# EAGLE design ctrl (EAGLE 8.2.2)
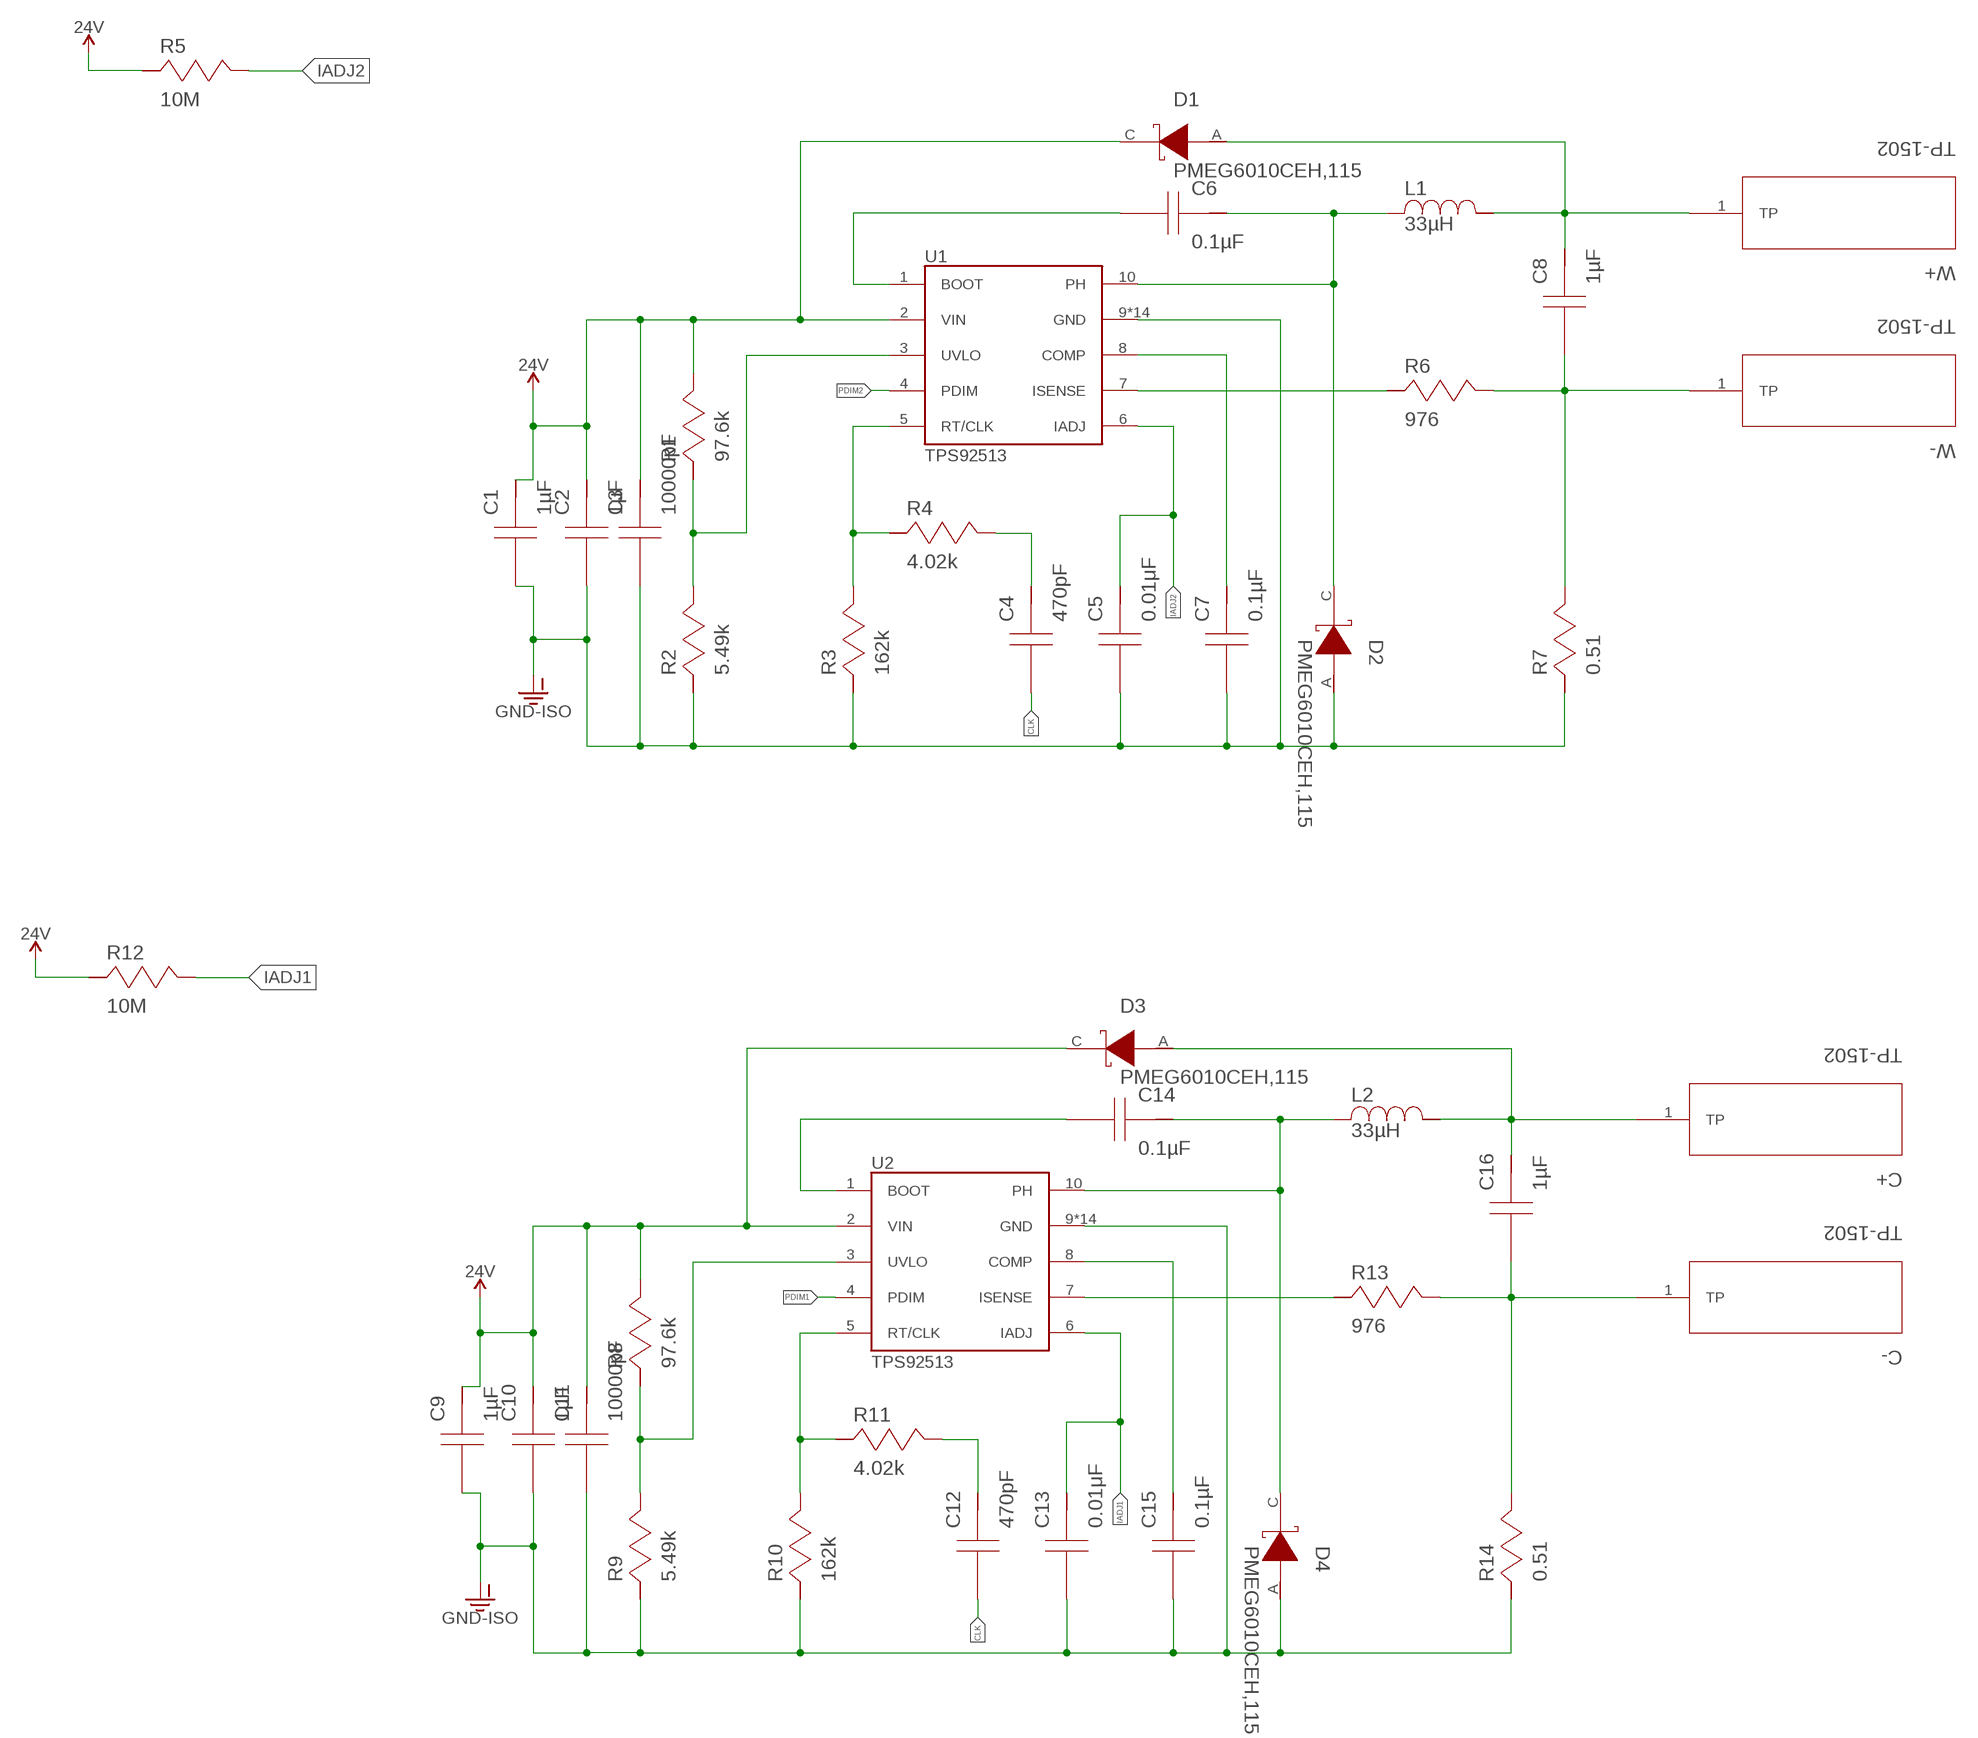
[diagram p0: schematic, sheet 1, part 1 of 2]
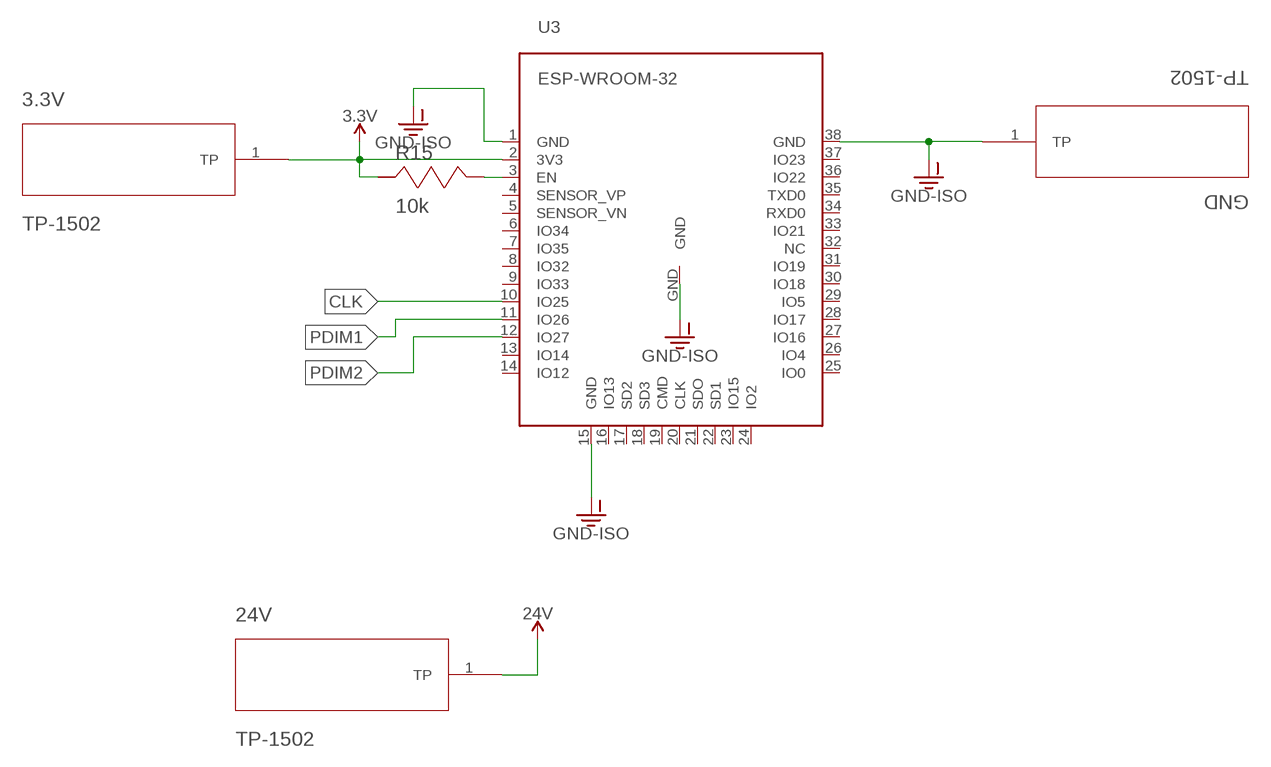
[diagram p1: schematic, sheet 1, part 2 of 2]

## Parts
3.3V  TP-1502  [TP-1502]
24V  TP-1502  [TP-1502]
C1  1µF  GRM31MR71H105KA88L  [1206]
C2  1µF  GRM31MR71H105KA88L  [1206]
C3  10000pF  GCM155R71H103KA55D  [0402]
C4  470pF  C0603X471K5RACTU  [0603]
C5  0.01μF  CC0805KRX7R9BB103  [0805]
C6  0.1µF  GRM188R71E104KA01D  [0603]
C7  0.1µF  CC0805KRX7R8BB104  [0805]
C8  1µF  GMK212B7105KG-T  [0805]
C9  1µF  GRM31MR71H105KA88L  [1206]
C10  1µF  GRM31MR71H105KA88L  [1206]
C11  10000pF  GCM155R71H103KA55D  [0402]
C12  470pF  C0603X471K5RACTU  [0603]
C13  0.01μF  CC0805KRX7R9BB103  [0805]
C14  0.1µF  GRM188R71E104KA01D  [0603]
C15  0.1µF  CC0805KRX7R8BB104  [0805]
C16  1µF  GMK212B7105KG-T  [0805]
C+  TP-1502  [TP-1502]
C-  TP-1502  [TP-1502]
D1  PMEG6010CEH,115  [SOD-123F]
D2  PMEG6010CEH,115  [SOD-123F]
D3  PMEG6010CEH,115  [SOD-123F]
D4  PMEG6010CEH,115  [SOD-123F]
GND  TP-1502  [TP-1502]
L1  33µH  SRN6045-330M  [SRN6045]
L2  33µH  SRN6045-330M  [SRN6045]
R1  97.6k  CRCW040297K6FKED  [0402]
R2  5.49k  CRCW04025K49FKED  [0402]
R3  162k  CRCW0402162KFKED  [0402]
R4  4.02k  CRCW06034K02FKEA  [0603]
R5  10M  CRCW040210M0JNED  [0402]
R6  976  CRCW0402976RFKED  [0402]
R7  0.51  CRM0805-FX-R510ELF  [0805]
R8  97.6k  CRCW040297K6FKED  [0402]
R9  5.49k  CRCW04025K49FKED  [0402]
R10  162k  CRCW0402162KFKED  [0402]
R11  4.02k  CRCW06034K02FKEA  [0603]
R12  10M  CRCW040210M0JNED  [0402]
R13  976  CRCW0402976RFKED  [0402]
R14  0.51  CRM0805-FX-R510ELF  [0805]
R15  10k  CRCW060310K0FKEA  [0603]
U1  TPS92513  [TPS92513]
U2  TPS92513  [TPS92513]
U3  ESP-WROOM-32  [ESP-WROOM-32]
W+  TP-1502  [TP-1502]
W-  TP-1502  [TP-1502]

## Nets
3.3V: 3.3V.1(TP) R15.2 U3.2(3V3)
24V: 24V.1(TP) C1.1 C2.1 C3.1 C9.1 C10.1 C11.1 D1.C D3.C R1.1 R5.2 R8.1 R12.2 U1.2(VIN) U2.2(VIN)
CLK: C4.2 C12.2 U3.10(IO25)
GND-ISO: C1.2 C2.2 C3.2 C5.2 C7.2 C9.2 C10.2 C11.2 C13.2 C15.2 D2.A D4.A GND.1(TP) R2.2 R3.2 R7.2 R9.2 R10.2 R14.2 U1.9(GND) U1.GND-ISO(GND) U1.P$1(GND) U1.P$2(GND) U1.P$3(GND) U1.P$4(GND) U1.P$5(GND) U1.P$6(GND) U1.P$7(GND) U1.P$8(GND) U1.P$9(GND) U1.P$10(GND) U1.P$11(GND) U1.P$12(GND) U2.9(GND) U2.GND-ISO(GND) U2.P$1(GND) U2.P$2(GND) U2.P$3(GND) U2.P$4(GND) U2.P$5(GND) U2.P$6(GND) U2.P$7(GND) U2.P$8(GND) U2.P$9(GND) U2.P$10(GND) U2.P$11(GND) U2.P$12(GND) U3.1(GND) U3.15(GND) U3.38(GND) U3.GND
IADJ1: C13.1 R12.1 U2.6(IADJ)
IADJ2: C5.1 R5.1 U1.6(IADJ)
N$1: R1.2 R2.1 U1.3(UVLO)
N$2: R8.2 R9.1 U2.3(UVLO)
N$3: C14.1 D4.C L2.1 U2.10(PH)
N$4: R10.1 R11.2 U2.5(RT/CLK)
N$5: C15.1 U2.8(COMP)
N$6: C14.2 U2.1(BOOT)
N$7: R13.2 U2.7(ISENSE)
N$8: C12.1 R11.1
N$9: C16.1 C+.1(TP) D3.A L2.2
N$10: C16.2 C-.1(TP) R13.1 R14.1
N$16: C6.1 D2.C L1.1 U1.10(PH)
N$17: R3.1 R4.2 U1.5(RT/CLK)
N$18: C7.1 U1.8(COMP)
N$19: C6.2 U1.1(BOOT)
N$20: R6.2 U1.7(ISENSE)
N$23: C8.1 D1.A L1.2 W+.1(TP)
N$25: C4.1 R4.1
N$26: C8.2 R6.1 R7.1 W-.1(TP)
N$29: R15.1 U3.3(EN)
PDIM1: U2.4(PDIM) U3.11(IO26)
PDIM2: U1.4(PDIM) U3.12(IO27)
Unconnected: U3.4(SENSOR_VP) U3.5(SENSOR_VN) U3.6(IO34) U3.7(IO35) U3.8(IO32) U3.9(IO33) U3.13(IO14) U3.14(IO12) U3.16(IO13) U3.17(SD2) U3.18(SD3) U3.19(CMD) U3.20(CLK) U3.21(SDO) U3.22(SD1) U3.23(IO15) U3.24(IO2) U3.25(IO0) U3.26(IO4) U3.27(IO16) U3.28(IO17) U3.29(IO5) U3.30(IO18) U3.31(IO19) U3.32(NC) U3.33(IO21) U3.34(RXD0) U3.35(TXD0) U3.36(IO22) U3.37(IO23)

## Library data of the parts
3.3V 24V C+ C- GND W+ W- = derek:TP-1502
C1 C2 C9 C10 = derek:GRM31MR71H105KA88L; DATASHEET_URL: http://www.murata.com/~/media/webrenewal/support/library/catalog/products/capacitor/mlcc/c02e.ashx; DIGIKEY_PART_NUMBER: 490-6527-1-ND; PART_NUMBER: GRM31MR71H105KA88L
C3 C11 = derek:GCM155R71H103KA55D; DATASHEET_URL: http://psearch.en.murata.com/capacitor/product/GCM155R71H103KA55%23.pdf; DIGIKEY_PART_NUMBER: 490-4762-1-ND; PART_NUMBER: GCM155R71H103KA55D
C4 C12 = derek:C0603X471K5RACTU; DATASHEET_URL: http://www.kemet.com/docfinder?Partnumber=C0603X471K5RACTU; DIGIKEY_PART_NUMBER: 399-5338-1-ND; MANUFACTURER: KEMET; PART_NUMBER: C0603X471K5RACTU
C5 C13 = derek:CC0805KRX7R9BB103; DATASHEET_URL: http://www.yageo.com/documents/recent/UPY-GPHC_X7R_6.3V-to-50V_17.pdf; DIGIKEY_PART_NUMBER: 311-1136-1-ND; PART_NUMBER: CC0805KRX7R9BB103
C6 C14 = derek:GRM188R71E104KA01D; DATASHEET_URL: http://www.murata.com/~/media/webrenewal/support/library/catalog/products/capacitor/mlcc/c02e.ashx; DIGIKEY_PART_NUMBER: 490-1524-1-ND; MANUFACTURER: Murata Electronics North America; PART_NUMBER: GRM188R71E104KA01D
C7 C15 = derek:CC0805KRX7R8BB104; DATASHEET_URL: http://www.yageo.com/documents/recent/UPY-GPHC_X7R_6.3V-to-50V_17.pdf; DIGIKEY_PART_NUMBER: 311-1141-1-ND; PART_NUMBER: CC0805KRX7R8BB104
C8 C16 = derek:GMK212B7105KG-T; DATASHEET_URL: http://ds.yuden.co.jp/TYCOMPAS/ut/detail.do?productNo=GMK212B7105KG-T&fileName=GMK212B7105KG-T_SS&mode=specSheetDownload; DIGIKEY_PART_NUMBER: 587-1438-1-ND; PART_NUMBER: GMK212B7105KG-T
D1-D4 = derek:PMEG6010CEH,115; DATASHEET_URL: http://assets.nexperia.com/documents/data-sheet/PMEG6010CEH_PMEG6010CEJ.pdf; DIGIKEY_PART_NUMBER: 1727-3848-1-ND; PART_NUMBER: PMEG6010CEH,115
L1 L2 = derek:SRN6045-330M; DATASHEET_URL: http://www.bourns.com/docs/Product-Datasheets/SRN6045.pdf; DIGIKEY_PART_NUMBER: SRN6045-330MCT-ND; PART_NUMBER: SRN6045-330M
R1 R8 = derek:CRCW040297K6FKED; DATASHEET_URL: http://www.vishay.com/docs/20035/dcrcwe3.pdf; DIGIKEY_PART_NUMBER: 541-97.6KLCT-ND; PART_NUMBER: CRCW040297K6FKED
R2 R9 = derek:CRCW04025K49FKED; DATASHEET_URL: http://www.vishay.com/docs/20035/dcrcwe3.pdf; DIGIKEY_PART_NUMBER: 541-5.49KLCT-ND; PART_NUMBER: CRCW04025K49FKED
R3 R10 = derek:CRCW0402162KFKED; DATASHEET_URL: http://www.vishay.com/docs/20035/dcrcwe3.pdf; DIGIKEY_PART_NUMBER: 541-162KLCT-ND; PART_NUMBER: CRCW0402162KFKED
R4 R11 = derek:CRCW06034K02FKEA; DATASHEET_URL: http://www.vishay.com/docs/20035/dcrcwe3.pdf; DIGIKEY_PART_NUMBER: 541-4.02KHCT-ND; MANUFACTURER: Vishay Dale; PART_NUMBER: CRCW06034K02FKEA
R5 R12 = derek:CRCW040210M0JNED; DATASHEET_URL: http://www.vishay.com/docs/20035/dcrcwe3.pdf; DIGIKEY_PART_NUMBER: 541-10MJCT-ND; MANUFACTURER: Vishay Dale; PART_NUMBER: CRCW040210M0JNED
R6 R13 = derek:CRCW0402976RFKED; DATASHEET_URL: http://www.vishay.com/docs/20035/dcrcwe3.pdf; DIGIKEY_PART_NUMBER: 541-976LCT-ND; PART_NUMBER: CRCW0402976RFKED
R7 R14 = derek:CRM0805-FX-R510ELF; DATASHEET_URL: http://www.bourns.com/docs/Product-Datasheets/CRM0805_1206_2010.pdf; DIGIKEY_PART_NUMBER: CRM0805-FX-R510ELFCT-ND; PART_NUMBER: CRM0805-FX-R510ELF
R15 = derek:CRCW060310K0FKEA; DATASHEET_URL: http://www.vishay.com/docs/20035/dcrcwe3.pdf; DIGIKEY_PART_NUMBER: 541-10.0KHCT-ND; MANUFACTURER: Vishay Dale; PART_NUMBER: CRCW060310K0FKEA
U1 U2 = derek:TPS92513; DATASHEET_URL: http://www.ti.com/lit/ds/symlink/tps92513.pdf; DIGIKEY_PART_NUMBER: 296-42113-1-ND; PART_NUMBER: TPS92513DGQT
U3 = derek:ESP-WROOM-32

## Board
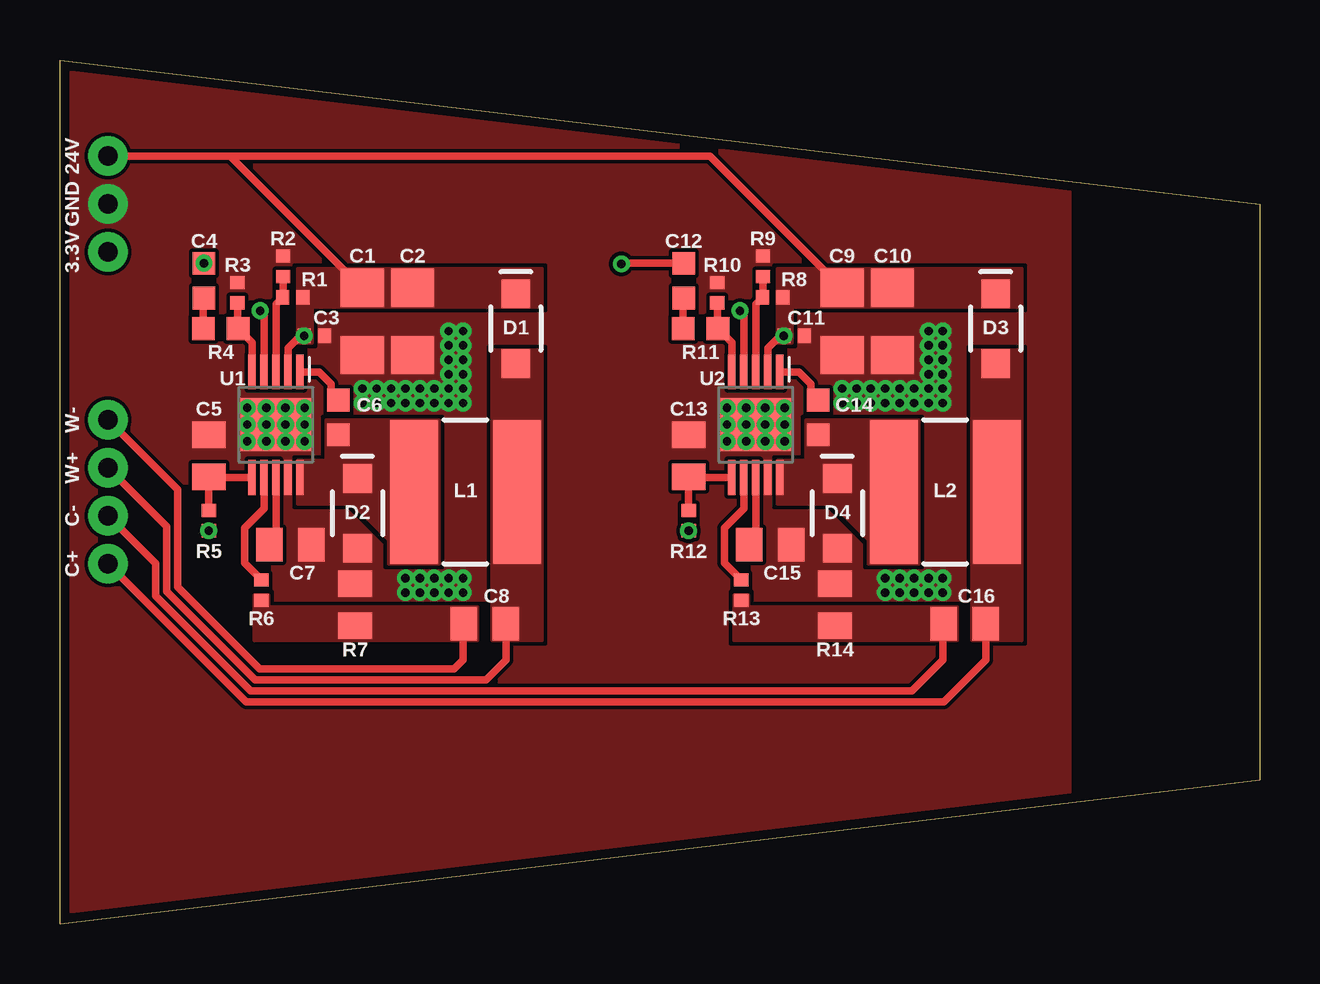
[diagram p2: board, top side]
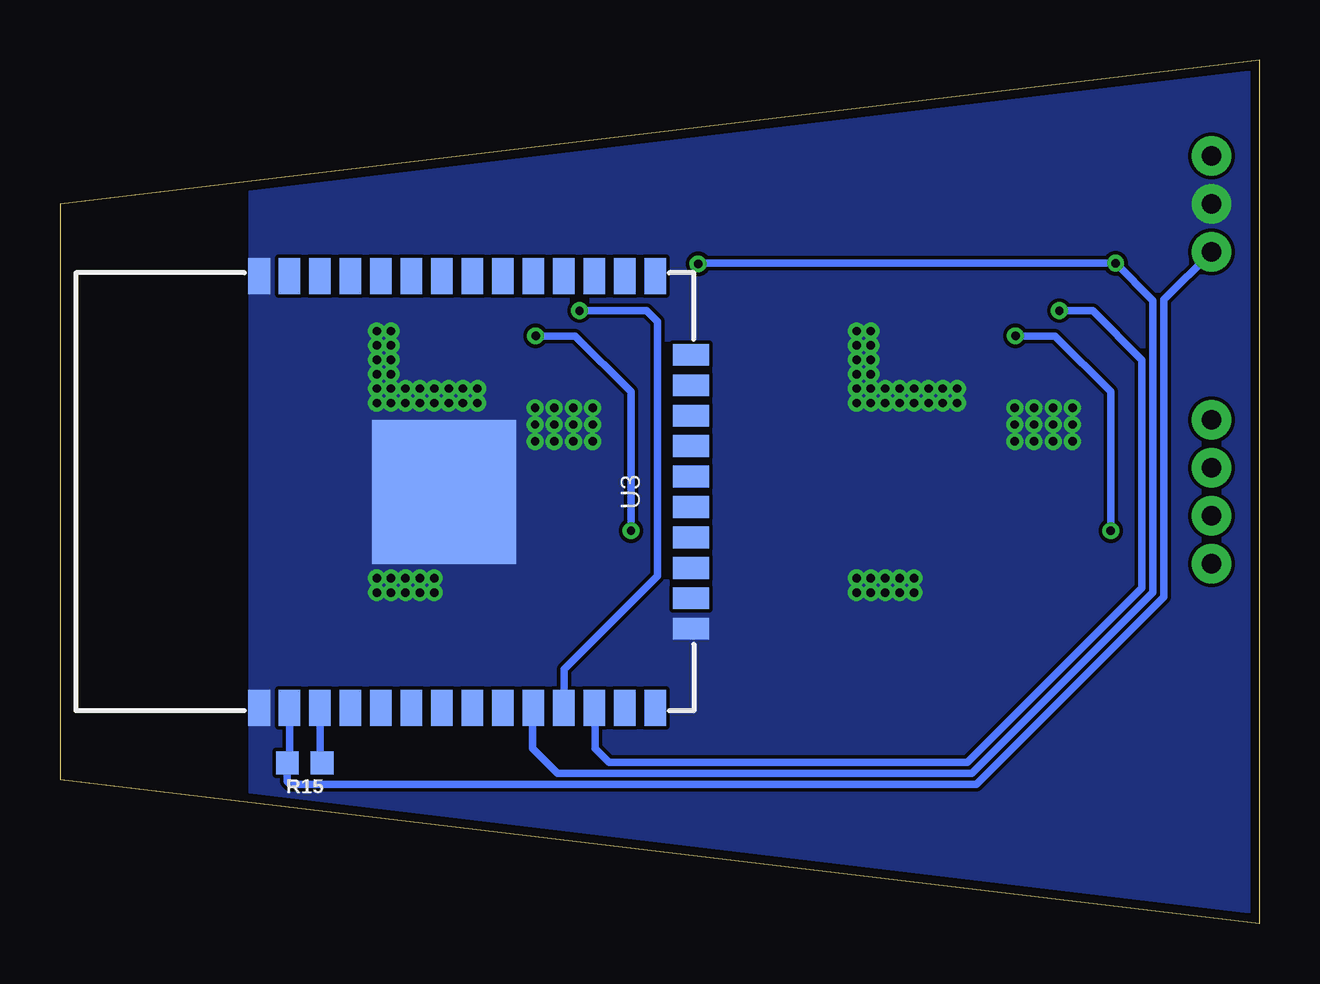
[diagram p3: board, bottom side, seen from below]

Size 50 x 36 mm. Coordinates in mm from the lower left corner, seen from the top.
Outline: 0,0 0,36 50,30 50,6 0,0
Copper layers (1*16): Top 0.0356mm / dielectric 1.5011mm / Bottom 0.0356mm
Design rules "LaenPCBOrder *": minimum track width 6mil, minimum drill 13mil, track to track 6mil, track to pad 6mil, pad to pad 6mil, via to via 6mil, smd to smd 6mil, copper to edge 15mil, drill to drill 6mil, minimum pad ring 7mil, minimum via ring 7mil, stop-mask expansion 3mil, vias tented up to drill 100mil, thermal gap 10mil

### Footprints (pad centres in the part's own frame; a part is rotated, then mirrored left to right if it is on the bottom)
TP-1502 = drill 0.813 pad 1.651: 1 0,0
1206 = smd 1.6 x 1.8: 1 -1.4,0; 2 1.4,0
0402 = smd 0.55 x 0.6: 1 -0.425,0; 2 0.425,0
0603 = smd 0.95 x 0.95: 1 -0.725,0; 2 0.725,0
0805 = smd 1.1 x 1.4: 1 -0.875,0; 2 0.875,0
SOD-123F = smd 1.2 x 1.2: A 1.45,0; C -1.45,0
SRN6045 = smd 2 x 6: 1 -2.15,0; 2 2.15,0
TPS92513 = smd 0.3 x 1.45: 1 -1,-2.2; 2 -0.5,-2.2; 3 0,-2.2; 4 0.5,-2.2; 5 1,-2.2; 6 1,2.2; 7 0.5,2.2; 8 0,2.2; 9 -0.5,2.2; 10 -1,2.2 | smd 3.1 x 2.2: GND-ISO 0,0 | drill 0.35: P$1 -1.2,0.7; P$2 -0.4,0.7; P$3 0.4,0.7; P$4 1.2,0.7; P$5 -1.2,0; P$6 -0.4,0; P$7 0.4,0; P$8 1.2,0; P$9 -1.2,-0.7; P$10 -0.4,-0.7; P$11 0.4,-0.7; P$12 1.2,-0.7
ESP-WROOM-32 = smd 0.9 x 1.5: 1 7.7,9; 2 6.43,9; 3 5.16,9; 4 3.89,9; 5 2.62,9; 6 1.35,9; 7 0.08,9; 8 -1.19,9; 9 -2.46,9; 10 -3.73,9; 11 -5,9; 12 -6.27,9; 13 -7.54,9; 14 -8.81,9; 25 -8.81,-9; 26 -7.54,-9; 27 -6.27,-9; 28 -5,-9; 29 -3.73,-9; 30 -2.46,-9; 31 -1.19,-9; 32 0.08,-9; 33 1.35,-9; 34 2.62,-9; 35 3.89,-9; 36 5.16,-9; 37 6.43,-9; 38 7.7,-9 | smd 1.5 x 0.9: 15 -10.3,5.715; 16 -10.3,4.445; 17 -10.3,3.175; 18 -10.3,1.905; 19 -10.3,0.635; 20 -10.3,-0.635; 21 -10.3,-1.905; 22 -10.3,-3.175; 23 -10.3,-4.445; 24 -10.3,-5.715 | smd 6 x 6: GND 0,0

### Placement (x,y rotation side)
3.3V  2,28 90 top
24V  2,32 90 top
C1  12.6,25.1 270 top
C2  14.7,25.1 270 top
C3  10.6,24.5 0 top
C4  6,26.8 90 top
C5  6.2,19.5 90 top
C6  11.6,21.1 90 top
C7  9.6,15.8 0 top
C8  17.7,12.5 180 top
C9  32.6,25.1 270 top
C10  34.7,25.1 270 top
C11  30.6,24.5 0 top
C12  26,26.8 90 top
C13  26.2,19.5 90 top
C14  31.6,21.1 90 top
C15  29.6,15.8 0 top
C16  37.7,12.5 180 top
C+  2,15 90 top
C-  2,17 90 top
D1  19,24.8 270 top
D2  12.4,17.1 270 top
D3  39,24.8 270 top
D4  32.4,17.1 270 top
GND  2,30 90 top
L1  16.9,18 0 top
L2  36.9,18 0 top
R1  9.7,26.1 180 top
R2  9.3,27.4 90 top
R3  7.4,26.3 90 top
R4  6.7,24.8 0 top
R5  6.2,16.8 270 top
R6  8.4,13.9 90 top
R7  12.3,13.3 90 top
R8  29.7,26.1 180 top
R9  29.3,27.4 90 top
R10  27.4,26.3 90 top
R11  26.7,24.8 0 top
R12  26.2,16.8 270 top
R13  28.4,13.9 90 top
R14  32.3,13.3 90 top
R15  39.8,6.7 180 bottom
U1  9,20.8 180 top
U2  29,20.8 180 top
U3  34,18 180 bottom
W+  2,19 90 top
W-  2,21 90 top

### Tracks (layer width: path | path; a pad name or v marks a point on that pad's centre or on a via)
3.3V
  Bottom 0.305: U3.2 40.43,6.79 R15.2 40.52,5.92 40.4,5.8 11.81,5.8 3.99,13.62 3.99,18.9 | 3.99,19.01 3.99,18.9 | 3.99,18.9 3.99,26.01 3.3V.1
24V  (via drill 0.35)
  Top 0.305: U1.2 9.5,24 10,24.5 v10.18,24.5 | U2.2 29.5,24 30,24.5 C11.1 | 6.67,32 24V.1 | 6.67,32 27.1,32 C9.1 | C1.1 7.1,32 6.67,32
  Bottom 0.305: R5.2 6.2,22.18 8.53,24.5 v10.18,24.5 | R12.2 26.2,22.18 28.52,24.5 C11.1
  other vias: 6.2,16.38 26.2,16.38 30.18,24.5
  pour Top (no thermals): 9.9,24.2 9.9,27.3 20.1,27.3 20.1,25.7 10.5,25.7 10.5,24.2
  pour Top (no thermals): 29.9,24.2 29.9,27.3 40.1,27.3 40.1,25.7 30.5,25.7 30.5,24.2
CLK  (via drill 0.35)
  Top 0.305: C12.2 23.32,27.52 v23.4,27.5
  Bottom 0.305: U3.10 30.3,8.97 30.3,7.3 29.26,6.26 12,6.26 4.44,13.81 4.44,25.97 v6,27.52 23.27,27.52 v23.4,27.5
GND-ISO  (via drill 0.35)
  other vias: 16.8,13.8 16.2,14.4 16.2,13.8 15.6,13.8 15.6,14.4 15,14.4 15,13.8 14.4,13.8 14.4,14.4 16.8,24.1 16.2,24.1 16.2,23.5 16.8,23.5 16.2,22.9 16.2,22.3 16.8,22.3 16.2,21.7 16.8,21.7 15.6,22.3 15.6,21.7 15,21.7 15,22.3 14.4,22.3 14.4,21.7 13.8,22.3 13.8,21.7 13.2,21.7 13.2,22.3 16.8,24.7 16.2,24.7 12.6,21.7 12.6,22.3 16.8,22.9 16.8,14.4 36.8,13.8 36.2,14.4 36.2,13.8 35.6,13.8 35.6,14.4 35,14.4 35,13.8 34.4,13.8 34.4,14.4 36.8,24.1 36.2,24.1 36.2,23.5 36.8,23.5 36.2,22.9 36.2,22.3 36.8,22.3 36.2,21.7 36.8,21.7 35.6,22.3 35.6,21.7 35,21.7 35,22.3 34.4,22.3 34.4,21.7 33.8,22.3 33.8,21.7 33.2,21.7 33.2,22.3 36.8,24.7 36.2,24.7 32.6,21.7 32.6,22.3 36.8,22.9 36.8,14.4
  pour Bottom (rank 3, no thermals): 0,36 42,36 42,0 0,0
  pour Top (rank 3, no thermals): 0,36 42,36 42,0 0,0
IADJ1
  Top 0.305: U2.6 26.23,18.6 C13.1 R12.1
IADJ2
  Top 0.305: U1.6 6.22,18.6 C5.1 R5.1
N$1
  Top 0.305: U1.3 9,25.82 R1.2 9.3,26.12 R2.1
N$2
  Top 0.305: U2.3 29,25.82 R8.2 29.3,26.12 R9.1
N$3
  pour Top (no thermals): 29.9,19.3 29.9,17.5 32.2,17.5 33.7,16 33.7,15 35.8,15 35.8,21 31.1,21 31.1,19.3
N$4
  Top 0.305: U2.5 28,24.23 R11.2 27.4,24.82 R10.1
N$5
  Top 0.305: U2.8 29,16.07 C15.1
N$6
  Top 0.305: U2.1 30.8,23 31.3,22.5 31.3,22.12 C14.2
N$7
  Top 0.305: U2.7 28.5,17.3 27.7,16.5 27.7,15.03 R13.2
N$8
  Top 0.305: R11.1 25.98,26.05 C12.1
N$9
  Top 0.305: C16.1 38.6,12.47 38.6,11 36.85,9.25 7.75,9.25 C+.1
  pour Top (no thermals): 40.1,23.9 40.1,11.8 38,11.8 38,23.9
N$10
  Top 0.305: C16.2 36.8,12.47 36.8,11 35.51,9.71 7.94,9.71 3.98,13.66 3.98,15.02 C-.1
  pour Top (rank 2, no thermals): 28.7,13.7 28.1,13.7 28.1,11.8 37.4,11.8 37.4,13.2 28.7,13.2
N$16
  pour Top (no thermals): 9.9,19.3 9.9,17.5 12.2,17.5 13.7,16 13.7,15 15.8,15 15.8,21 11.1,21 11.1,19.3
N$17
  Top 0.305: U1.5 8,24.23 R4.2 7.4,24.82 R3.1
N$18
  Top 0.305: U1.8 9,16.07 C7.1
N$19
  Top 0.305: U1.1 10.8,23 11.3,22.5 11.3,22.12 C6.2
N$20
  Top 0.305: U1.7 8.5,17.3 7.7,16.5 7.7,15.03 R6.2
N$23
  Top 0.305: C8.1 18.6,12.47 18.6,11 17.76,10.16 8.13,10.16 4.44,13.85 4.44,16.56 W+.1
  pour Top (no thermals): 20.1,23.9 20.1,11.8 18,11.8 18,23.9
N$25
  Top 0.305: R4.1 5.97,26.05 C4.1
N$26
  Top 0.305: C8.2 16.8,12.47 16.8,11 16.42,10.62 8.32,10.62 4.9,14.04 4.9,18.1 W-.1
  pour Top (rank 2, no thermals): 8.7,13.7 8.1,13.7 8.1,11.8 17.4,11.8 17.4,13.2 8.7,13.2
N$29
  Bottom 0.305: U3.3 39.16,6.79 R15.1
PDIM1  (via drill 0.35)
  Top 0.305: U2.4 28.5,25.39 v28.34,25.55
  Bottom 0.305: v28.34,25.55 25.55,25.55 25.1,25.1 25.1,14.5 29,10.6 U3.11
PDIM2  (via drill 0.35)
  Top 0.305: U1.4 8.5,25.39 v8.34,25.55
  Bottom 0.305: v8.34,25.55 6.95,25.55 4.9,23.5 4.9,14 12.19,6.71 27.11,6.71 27.7,7.3 27.7,8.97 U3.12 27.7,9.03